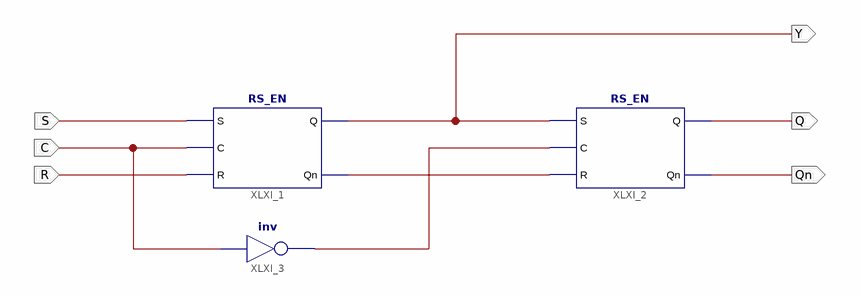
[diagram p0: schematic sheet 1]
// Xilinx ISE schematic RS_Trig.sch (kintex7) as structural Verilog: 3 symbols, 6 ports
module RS_Trig (
  input  S,
  input  R,
  input  C,
  output Y,
  output Q,
  output Qn
);

  wire XLXN_2, XLXN_9;

  RS_EN XLXI_1 (.S(S), .C(C), .R(R), .Q(Y), .Qn(XLXN_2));
  RS_EN XLXI_2 (.S(Y), .C(XLXN_9), .R(XLXN_2), .Q(Q), .Qn(Qn));
  not XLXI_3 (XLXN_9, C);
endmodule
